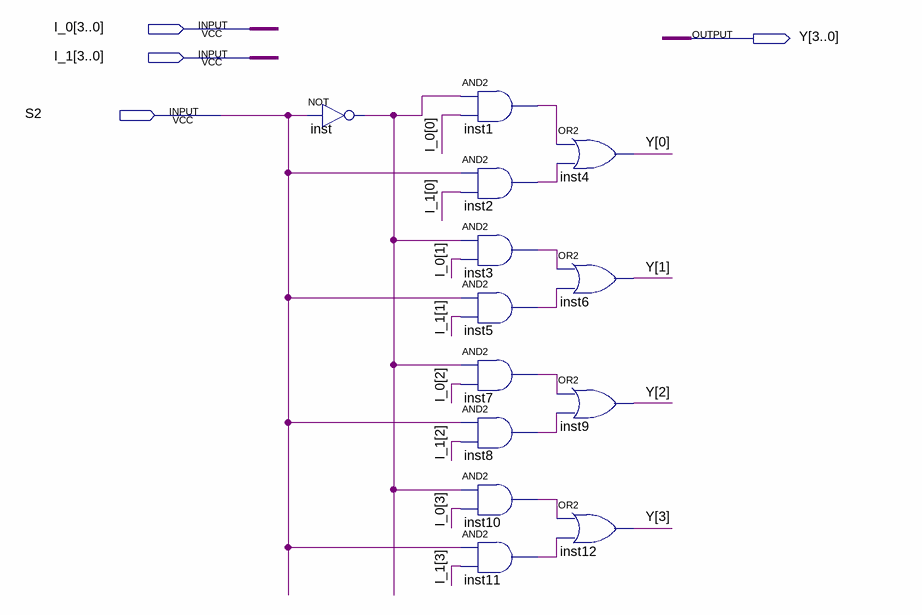
[diagram p0: schematic sheet]
// Quartus schematic Multi21.bdf as structural Verilog: 13 symbols, 4 pins
module Multi21 (
  input  [3:0] I_0,
  input  [3:0] I_1,
  input  S2,
  output [3:0] Y
);

  wire inst1_out, inst2_out, inst3_out, inst5_out, inst7_out, inst8_out, inst10_out, inst11_out, inst_out;

  not inst (inst_out, S2);
  and inst1 (inst1_out, inst_out, I_0[0]);
  and inst2 (inst2_out, S2, I_1[0]);
  and inst3 (inst3_out, inst_out, I_0[1]);
  and inst5 (inst5_out, S2, I_1[1]);
  and inst7 (inst7_out, inst_out, I_0[2]);
  and inst8 (inst8_out, S2, I_1[2]);
  and inst10 (inst10_out, inst_out, I_0[3]);
  and inst11 (inst11_out, S2, I_1[3]);
  or inst4 (Y[0], inst1_out, inst2_out);
  or inst6 (Y[1], inst3_out, inst5_out);
  or inst9 (Y[2], inst7_out, inst8_out);
  or inst12 (Y[3], inst10_out, inst11_out);
endmodule
